# EAGLE design RX BREAKOUT_RHS_2.2 (EAGLE 7.1.0)
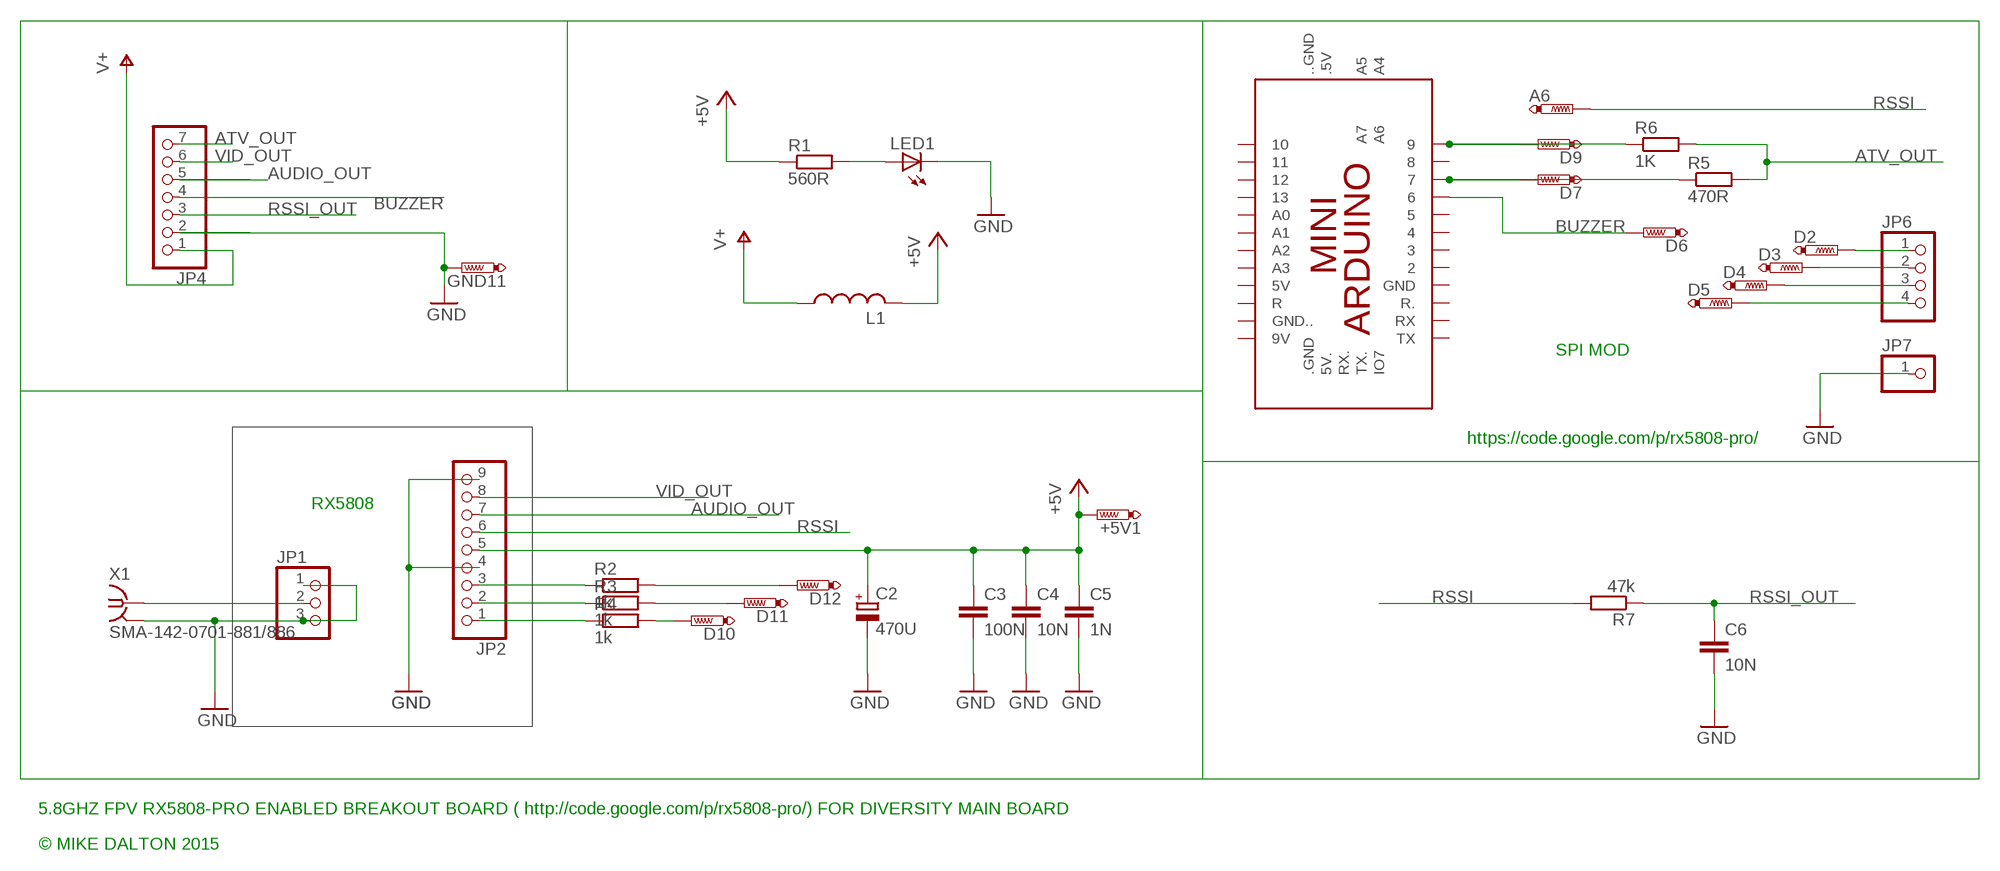
[diagram p0: schematic, sheet 1]

## Parts
+5V1  PTR1TP16SQ  [TP16SQ]
A6  PTR1TP16SQ  [TP16SQ]
C2  470U  CPOL-EUE5-10.5  [E5-10,5]
C3  100N  C-EUC0603K  [C0603K]
C4  10N  C-EUC0603K  [C0603K]
C5  1N  C-EUC0603K  [C0603K]
C6  10N  C-EUC0603K  [C0603K]
D2  PTR1TP16SQ  [TP16SQ]
D3  PTR1TP16SQ  [TP16SQ]
D4  PTR1TP16SQ  [TP16SQ]
D5  PTR1TP16SQ  [TP16SQ]
D6  PTR1TP16SQ  [TP16SQ]
D7  PTR1TP16SQ  [TP16SQ]
D9  PTR1TP16SQ  [TP16SQ]
D10  PTR1TP16SQ  [TP16SQ]
D11  PTR1TP16SQ  [TP16SQ]
D12  PTR1TP16SQ  [TP16SQ]
GND11  PTR1TP16SQ  [TP16SQ]
JP1  PINHD-1X3  [1X03]
JP2  PINHD-1X9  [1X09]
JP4  PINHD-1X7  [1X07]
JP6  PINHD-1X4  [1X04]
JP7  PINHD-1X1  [1X01]
L1  L-USL4532C  [L4532M]
LED1  LEDSMT1206  [1206]
PCB1  ARDUINO_MINI_EXT  (no package)
R1  560R  R-EU_R0603  [R0603]
R2  1k  R-EU_R0603  [R0603]
R3  1k  R-EU_R0603  [R0603]
R4  1k  R-EU_R0603  [R0603]
R5  470R  R-EU_R0603  [R0603]
R6  1K  R-EU_R0603  [R0603]
R7  47k  R-EU_R0603  [R0603]
X1  SMA-142-0701-881/886  [J502-ND-142-0701-881/886]

## Nets
ATV_OUT: JP4.7 R5.2 R6.2
AUDIO_OUT: JP2.7 JP4.5
BUZZER: D6.TP JP4.4 PCB1.6
D7: D7.TP PCB1.7 R5.1
D9: D9.TP PCB1.9 R6.1
GND: C2.- C3.2 C4.2 C5.2 C6.2 GND11.TP JP1.1 JP1.3 JP2.4 JP2.9 JP4.2 JP7.1 LED1.C X1.G@1 X1.G@2 X1.G@3 X1.G@4
N$1: D12.TP R2.2
N$2: JP2.3 R2.1
N$3: D11.TP R3.2
N$4: LED1.A R1.2
N$5: JP1.2 X1.1
N$7: D10.TP R4.2
N$9: JP2.2 R3.1
N$11: +5V1.TP C2.+ C3.1 C4.1 C5.1 JP2.5 L1.2 R1.1 ; supply symbol labelled +5V
N$12: JP2.1 R4.1
N$13: D2.TP JP6.1
N$15: D3.TP JP6.2
N$16: D4.TP JP6.3
N$17: D5.TP JP6.4
RSSI: A6.TP JP2.6 R7.2
RSSI_OUT: C6.1 JP4.3 R7.1
V+: JP4.1 L1.1
VID_OUT: JP2.8 JP4.6
Unconnected: PCB1.2 PCB1.3 PCB1.4 PCB1.5 PCB1.5V PCB1.5V. PCB1.8 PCB1.9V PCB1.10 PCB1.11 PCB1.12 PCB1.13 PCB1..5V PCB1...GND PCB1..GND PCB1.A0 PCB1.A1 PCB1.A2 PCB1.A3 PCB1.A4 PCB1.A5 PCB1.A6 PCB1.A7 PCB1.GND PCB1.GND.. PCB1.IO7 PCB1.R PCB1.R. PCB1.RX PCB1.RX. PCB1.TX PCB1.TX.

## Notes on the sheet
- SPI MOD
- https://code.google.com/p/rx5808-pro/
- RX5808
- 5.8GHZ FPV RX5808-PRO ENABLED BREAKOUT BOARD ( http://code.google.com/p/rx5808-pro/) FOR DIVERSITY MAIN BOARD
- © MIKE DALTON 2015

## Library data of the parts
+5V1 A6 D2-D7 D9-D12 GND11 = testpad:PTR1: TEST PIN
C2 = rcl:CPOL-EU: POLARIZED CAPACITOR, European symbol
C3-C6 = rcl:C-EU: CAPACITOR, European symbol
JP1 = pinhead:PINHD-1X3: PIN HEADER
JP2 = pinhead:PINHD-1X9: PIN HEADER
JP4 = pinhead:PINHD-1X7: PIN HEADER
JP6 = pinhead:PINHD-1X4: PIN HEADER
JP7 = pinhead:PINHD-1X1: PIN HEADER
L1 = resistor:L-US: INDUCTOR, American symbol
LED1 = led:LED: LED OSRAM: - CHIPLED LG R971, LG N971, LY N971, LG Q971, LY Q971, LO R971, LY R971 LH N974, LH R974 LS Q976, LO Q976, LY Q976 LO Q996 - Hyper CHIPLED LW Q18S LB Q993, LB Q99A, LB R99A - SideLED LS A670, LO A670, LY A670, LG A670, LP A670 LB A673, LV A673, LT A673, LW A673 LH A674 LY A675 LS A676, LA A676, LO A676, LY A676, LW A676 LS A679, LY A679, LG A679 - Hyper Micro SIDELED® LS Y876, LA Y876, LO Y876, LY Y876 LT Y87S - SmartLED LW L88C, LW L88S LB L89C, LB L89S, LG L890 LS L89K, LO L89K, LY L89K LS L896, LA L896, LO L896, LY L896 - TOPLED LS T670, LO T670, LY T670, LG T670, LP T670 LSG T670, LSP T670, LSY T670, LOP T670, LYG T670 LG T671, LOG T671, LSG T671 LB T673, LV T673, LT T673, LW T673 LH T674 LS T676, LA T676, LO T676, LY T676, LB T676, LH T676, LSB T676, LW T676 LB T67C, LV T67C, LT T67C, LS T67K, LO T67K, LY T67K, LW E67C LS E67B, LA E67B, LO E67B, LY E67B, LB E67C, LV E67C, LT E67C LW T67C LS T679, LY T679, LG T679 LS T770, LO T770, LY T770, LG T770, LP T770 LB T773, LV T773, LT T773, LW T773 LH T774 LS E675, LA E675, LY E675, LS T675 LS T776, LA T776, LO T776, LY T776, LB T776 LHGB T686 LT T68C, LB T68C - Hyper Mini TOPLED® LB M676 - Mini TOPLED Santana® LG M470 LS M47K, LO M47K, LY M47K Source: http://www.osram.convergy.de LUXEON: - LUMILED® LXK2-PW12-R00, LXK2-PW12-S00, LXK2-PW14-U00, LXK2-PW14-V00 LXK2-PM12-R00, LXK2-PM12-S00, LXK2-PM14-U00 LXK2-PE12-Q00, LXK2-PE12-R00, LXK2-PE12-S00, LXK2-PE14-T00, LXK2-PE14-U00 LXK2-PB12-K00, LXK2-PB12-L00, LXK2-PB12-M00, LXK2-PB14-N00, LXK2-PB14-P00, LXK2-PB14-Q00 LXK2-PR12-L00, LXK2-PR12-M00, LXK2-PR14-Q00, LXK2-PR14-R00 LXK2-PD12-Q00, LXK2-PD12-R00, LXK2-PD12-S00 LXK2-PH12-R00, LXK2-PH12-S00 LXK2-PL12-P00, LXK2-PL12-Q00, LXK2-PL12-R00 Source: www.luxeon.com KINGBRIGHT: KA-3528ASYC Source: www.kingbright.com
PCB1 = E14_Arduino_published:ARDUINO_MINI_EXT: Device for representing an Arduino Mini board in an EAGLE design without the PCB footprint. Created by Dave Young for Element14. More EAGLE documentation at: http://www.element14.com/community/community/knode/cadsoft_eagle
R1-R7 = resistor:R-EU_: RESISTOR, European symbol
X1 = con-coax:SMA-: SMA 50 Ohm End Launch Jack Receptacle - Round Contact Johnson Components Source: www.johnsoncomponents.com .. J502-ND.pdf; MF: JOHNSON COMPONENTS; MPN: 142-0701-881; OC_FARNELL: 1608603; OC_NEWARK: 08B906

## Board
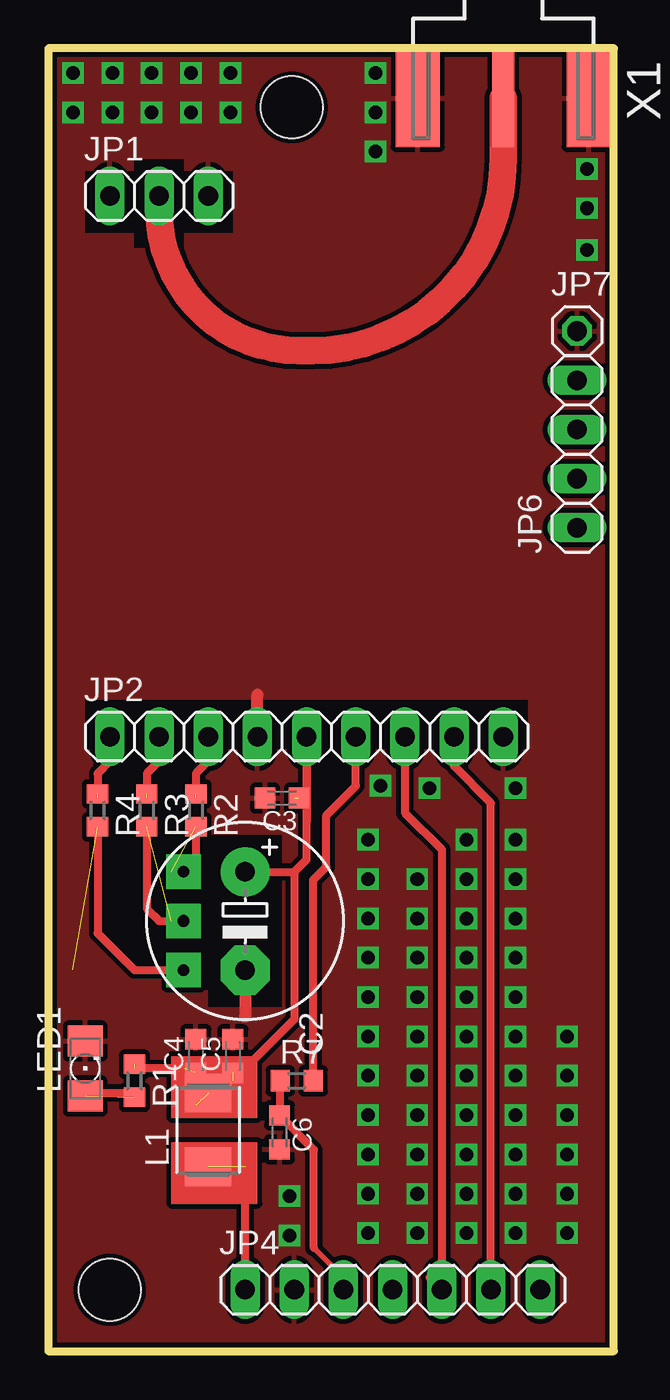
[diagram p1: board, top side]
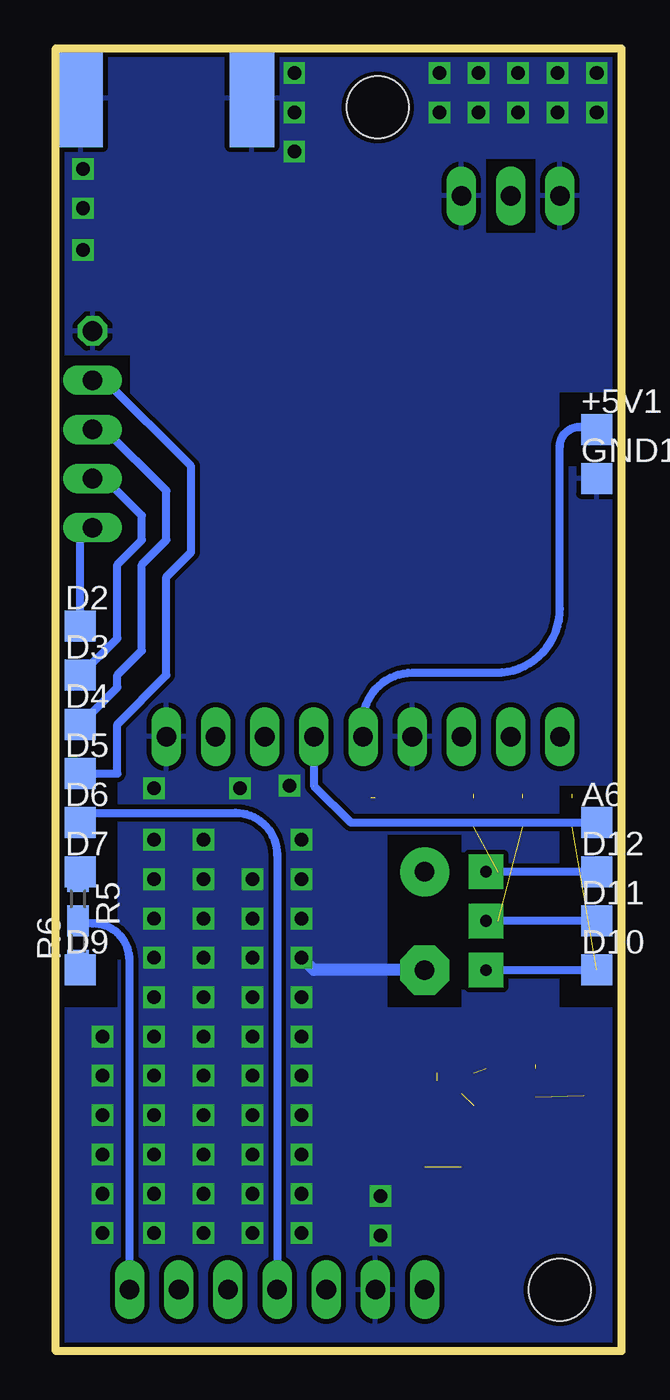
[diagram p2: board, bottom side, seen from below]

Size 29.21 x 67.31 mm. Coordinates in mm from the lower left corner, seen from the top.
Outline: 0,67.31 0,0 29.21,0 29.21,67.31 0,67.31
Copper layers (1*16): Top 0.035mm / dielectric 1.5mm / Bottom 0.035mm
Design rules "default *": minimum track width 10mil, minimum drill 24mil, track to track 10mil, track to pad 10mil, pad to pad 10mil, via to via 10mil, smd to smd 10mil, copper to edge 10mil, drill to drill 10mil, minimum pad ring 10mil, minimum via ring 8mil, stop-mask expansion 4mil, vias tented up to drill 0mil, thermal gap 10mil
Holes 3.2 mm at 12.57,64.26 3.18,3.18
tRestrict: area 1.9,57.8 to 9.5,61; area 1.9,31.1 to 24.8,33.7; area 8.3,17.8 to 12.1,26.7; area 4.4,57 to 7,61.6
bRestrict: area 0,17.8 to 3.2,29.2; area 26,17.8 to 29.2,39.4; area 0.6,45.7 to 3.2,49.5; area 25.4,48.9 to 29.2,51.4; area 4.4,57.8 to 7,61.6; area 8.3,17.8 to 12.1,26.7

### Footprints (pad centres in the part's own frame; a part is rotated, then mirrored left to right if it is on the bottom)
TP16SQ = smd 1.6 x 1.6: TP 0,0
E5-10,5 = drill 1.016 pad 2.54: + -2.54,0 | drill 1.016 pad 2.54 octagon: - 2.54,0
C0603K = smd 1.05 x 1.08: 1 -0.875,0; 2 0.875,0
1X03 = drill 1.016 long: 1 -2.54,0; 2 0,0; 3 2.54,0
1X09 = drill 1.016 long: 1 -10.16,0; 2 -7.62,0; 3 -5.08,0; 4 -2.54,0; 5 0,0; 6 2.54,0; 7 5.08,0; 8 7.62,0; 9 10.16,0
1X07 = drill 1.016 long: 1 -7.62,0; 2 -5.08,0; 3 -2.54,0; 4 0,0; 5 2.54,0; 6 5.08,0; 7 7.62,0
1X04 = drill 1.016 long: 1 -3.81,0; 2 -1.27,0; 3 1.27,0; 4 3.81,0
1X01 = drill 1.016 octagon: 1 0,0
L4532M = smd 2 x 2.4: 1 -1.9,0; 2 1.9,0
1206 = smd 1.6 x 1.803: A -1.422,0; C 1.422,0
R0603 = smd 1 x 1.1: 1 -0.85,0; 2 0.85,0
J502-ND-142-0701-881/886 = smd 5.08 x 1.143: 1 2.565,0 | smd 5.08 x 2.286: G@1 2.565,4.42; G@2 2.565,-4.42 | smd 5.08 x 2.286 bottom: G@3 2.565,4.42; G@4 2.565,-4.42

### Placement (x,y rotation side)
+5V1  1.27,47.62 0 bottom
A6  1.27,27.31 0 bottom
C2  10.16,22.22 270 top
C3  12.07,28.57 180 top
C4  7.62,15.24 90 top
C5  9.53,15.24 90 top
C6  11.94,11.3 270 top
D2  27.94,37.47 0 bottom
D3  27.94,34.92 0 bottom
D4  27.94,32.39 0 bottom
D5  27.94,29.85 0 bottom
D6  27.94,27.31 0 bottom
D7  27.94,24.77 0 bottom
D9  27.94,19.68 0 bottom
D10  1.27,19.68 0 bottom
D11  1.27,22.22 0 bottom
D12  1.27,24.77 0 bottom
GND11  1.27,45.08 0 bottom
JP1  5.71,59.69 0 top
JP2  13.34,31.75 0 top
JP4  17.78,3.18 0 top
JP6  27.31,46.36 90 top
JP7  27.31,52.7 0 top
L1  8.25,11.43 90 top
LED1  1.91,14.61 90 top
R1  4.45,13.97 270 top
R2  7.62,27.94 270 top
R3  5.08,27.94 270 top
R4  2.54,27.94 270 top
R5  28.07,23.37 270 bottom
R6  28.07,21.08 90 bottom
R7  12.83,13.97 0 top
X1  23.5,67.31 270 top

### Tracks (layer width: path | path; a pad name or v marks a point on that pad's centre or on a via)
ATV_OUT
  Bottom 0.406: R5.2 R6.2 arc90 27.9,22.1 27.31,22.1 arc90 25.4,20.19 JP4.7
AUDIO_OUT
  Top 0.406: 19.68,3.81 JP4.5 20.32,25.91 18.42,27.81 JP2.7
BUZZER
  Bottom 0.406: JP4.4 17.78,25.65 arc-90 19.94,27.81 27.43,27.81 D6.TP
D7
  Bottom 0.406: D7.TP 28.07,24.38 R5.1
D9
  Bottom 0.406: D9.TP 28.07,19.68 R6.1 | R6.1 28.07,20.32 28.32,20.32 28.32,20.23 | R6.1 28.32,20.23 | 28.32,20.23 28.32,20.07
D10  (via drill 0.6 pad 1.78)
  Top 0.406: 2.54,27.31 2.54,21.59 4.45,19.68 v6.99,19.68
D11  (via drill 0.6 pad 1.78)
  Top 0.406: 5.08,27.31 5.08,22.86 5.71,22.22 v6.99,22.22
D12  (via drill 0.6 pad 1.78)
  Top 0.406: 7.62,27.31 7.62,25.4 v6.99,24.77
GND  (via drill 0.7)
  Top 0.61: JP2.4 10.79,33.91 | C2.- 10.16,17.27
  Bottom 0.61: C2.- 15.88,19.68 v16.51,20.32
  other vias: 16.51,16.26 16.51,14.22 16.51,12.19 16.51,10.16 19.05,10.16 19.05,12.19 19.05,14.22 19.05,16.26 21.59,16.26 21.59,14.22 21.59,12.19 21.59,10.16 21.59,8.13 19.05,8.13 16.51,8.13 16.51,6.1 19.05,6.1 21.59,6.1 24.13,6.1 24.13,8.13 24.13,10.16 24.13,12.19 24.13,14.22 24.13,16.26 26.8,16.26 26.8,14.22 26.8,12.19 26.8,10.16 26.8,8.13 26.8,6.1 16.51,18.29 19.05,18.29 21.59,18.29 24.13,18.29 24.13,20.32 21.59,20.32 19.05,20.32 16.51,22.35 19.05,22.35 21.59,22.35 24.13,22.35 24.13,24.38 24.13,26.42 21.59,24.38 21.59,26.42 19.05,24.38 16.51,24.38 16.51,26.42 17.14,29.21 19.68,29.08 24.13,29.08 1.27,64.01 27.81,61.09 27.81,59.05 16.89,66.04 9.4,66.04 16.89,64.01 9.4,64.01 3.3,64.01 27.81,56.9 5.33,64.01 7.37,66.04 3.3,66.04 5.33,66.04 1.27,66.04 16.89,61.98 12.45,5.97 12.45,8 7.37,64.01
  pour Bottom: -0.25,-0.38 -0.25,67.56 29.59,67.56 29.59,-0.38
  pour Top: -0.89,68.07 -0.89,-1.14 29.85,-1.14 29.85,68.07
N$1  (1 unrouted)
  Bottom 0.406: D12.TP 6.35,24.77
N$2  (1 unrouted)
  Top 0.406: JP2.3 8.25,30.48 7.62,29.85 7.62,28.57
N$3  (1 unrouted)
  Bottom 0.406: D11.TP 6.35,22.22
N$4  (1 unrouted)
N$5
  Top 1.422: JP1.2 5.71,58.93 arc90 12.95,51.69 13.59,51.69 arc90 23.5,61.59 X1.1
N$7  (1 unrouted)
  Bottom 0.406: 6.35,19.68 D10.TP
N$8
  Top 0.406: 1.91,13.34 4.45,13.34
N$9  (1 unrouted)
  Top 0.406: JP2.2 5.71,30.48 5.08,29.85 5.08,28.57
N$11  (5 unrouted)
  Top 0.406: 13.34,28.57 JP2.5 13.34,25.4 12.7,24.77 | 13.34,28.57 13.34,27.31 | 12.7,28.57 13.34,28.57 | C2.+ 12.7,24.77 | 12.7,24.77 12.7,17.14 9.53,13.97 8.89,14.61 6.99,14.61 | 6.99,14.61 7.62,12.7 | 6.99,14.61 4.45,14.61
  Bottom 0.406: JP2.5 13.34,32.51 arc90 10.79,35.05 6.48,35.05 arc-90 3.18,38.35 3.18,46.74 arc90 2.16,47.75 1.4,47.75 arc90 +5V1.TP
N$12  (1 unrouted)
  Top 0.406: JP2.1 3.18,30.48 2.54,29.85 2.54,28.57
N$13
  Bottom 0.406: D2.TP 27.94,42.55 JP6.1
N$15
  Bottom 0.406: D3.TP 26.04,36.83 26.04,40.64 24.77,41.91 24.77,43.18 26.67,45.08 JP6.2
N$16
  Bottom 0.406: D4.TP 26.04,34.29 26.04,34.92 24.77,36.2 24.77,40.64 23.5,41.91 23.5,44.45 26.67,47.62 JP6.3
N$17
  Bottom 0.406: D5.TP 26.04,29.85 26.04,32.39 23.5,34.92 23.5,40 22.23,41.28 22.23,45.72 26.67,50.17 JP6.4
RSSI  (1 unrouted)
  Top 0.406: 13.72,13.8 R7.2 13.68,24.35 14.35,25.02 14.35,27.69 15.88,29.21 15.88,31.88
  Bottom 0.406: JP2.6 15.88,29.21 13.97,27.31 A6.TP
RSSI_OUT
  Top 0.254: JP4.3 15.24,3.81 13.72,5.33
  Top 0.406: R7.1 arc90 11.94,13.8 C6.1 13.72,10.4 13.72,5.33
V+  (1 unrouted)
  Top 0.406: JP4.1 10.16,9.53
VID_OUT
  Top 0.406: JP4.6 22.86,28.32 20.96,30.23 JP2.8
(copper drawn outside any net)
  shapes: Top area x4

### Text on the board
_tsilk: 5.8GHZ FPV RX5808-PRO ENABLED BREAKOUT BOARD ( http://code.google.com/p/rx5808-pro/) | FOR DIVERSITY MAIN BOARD | © MIKE DALTON 2015